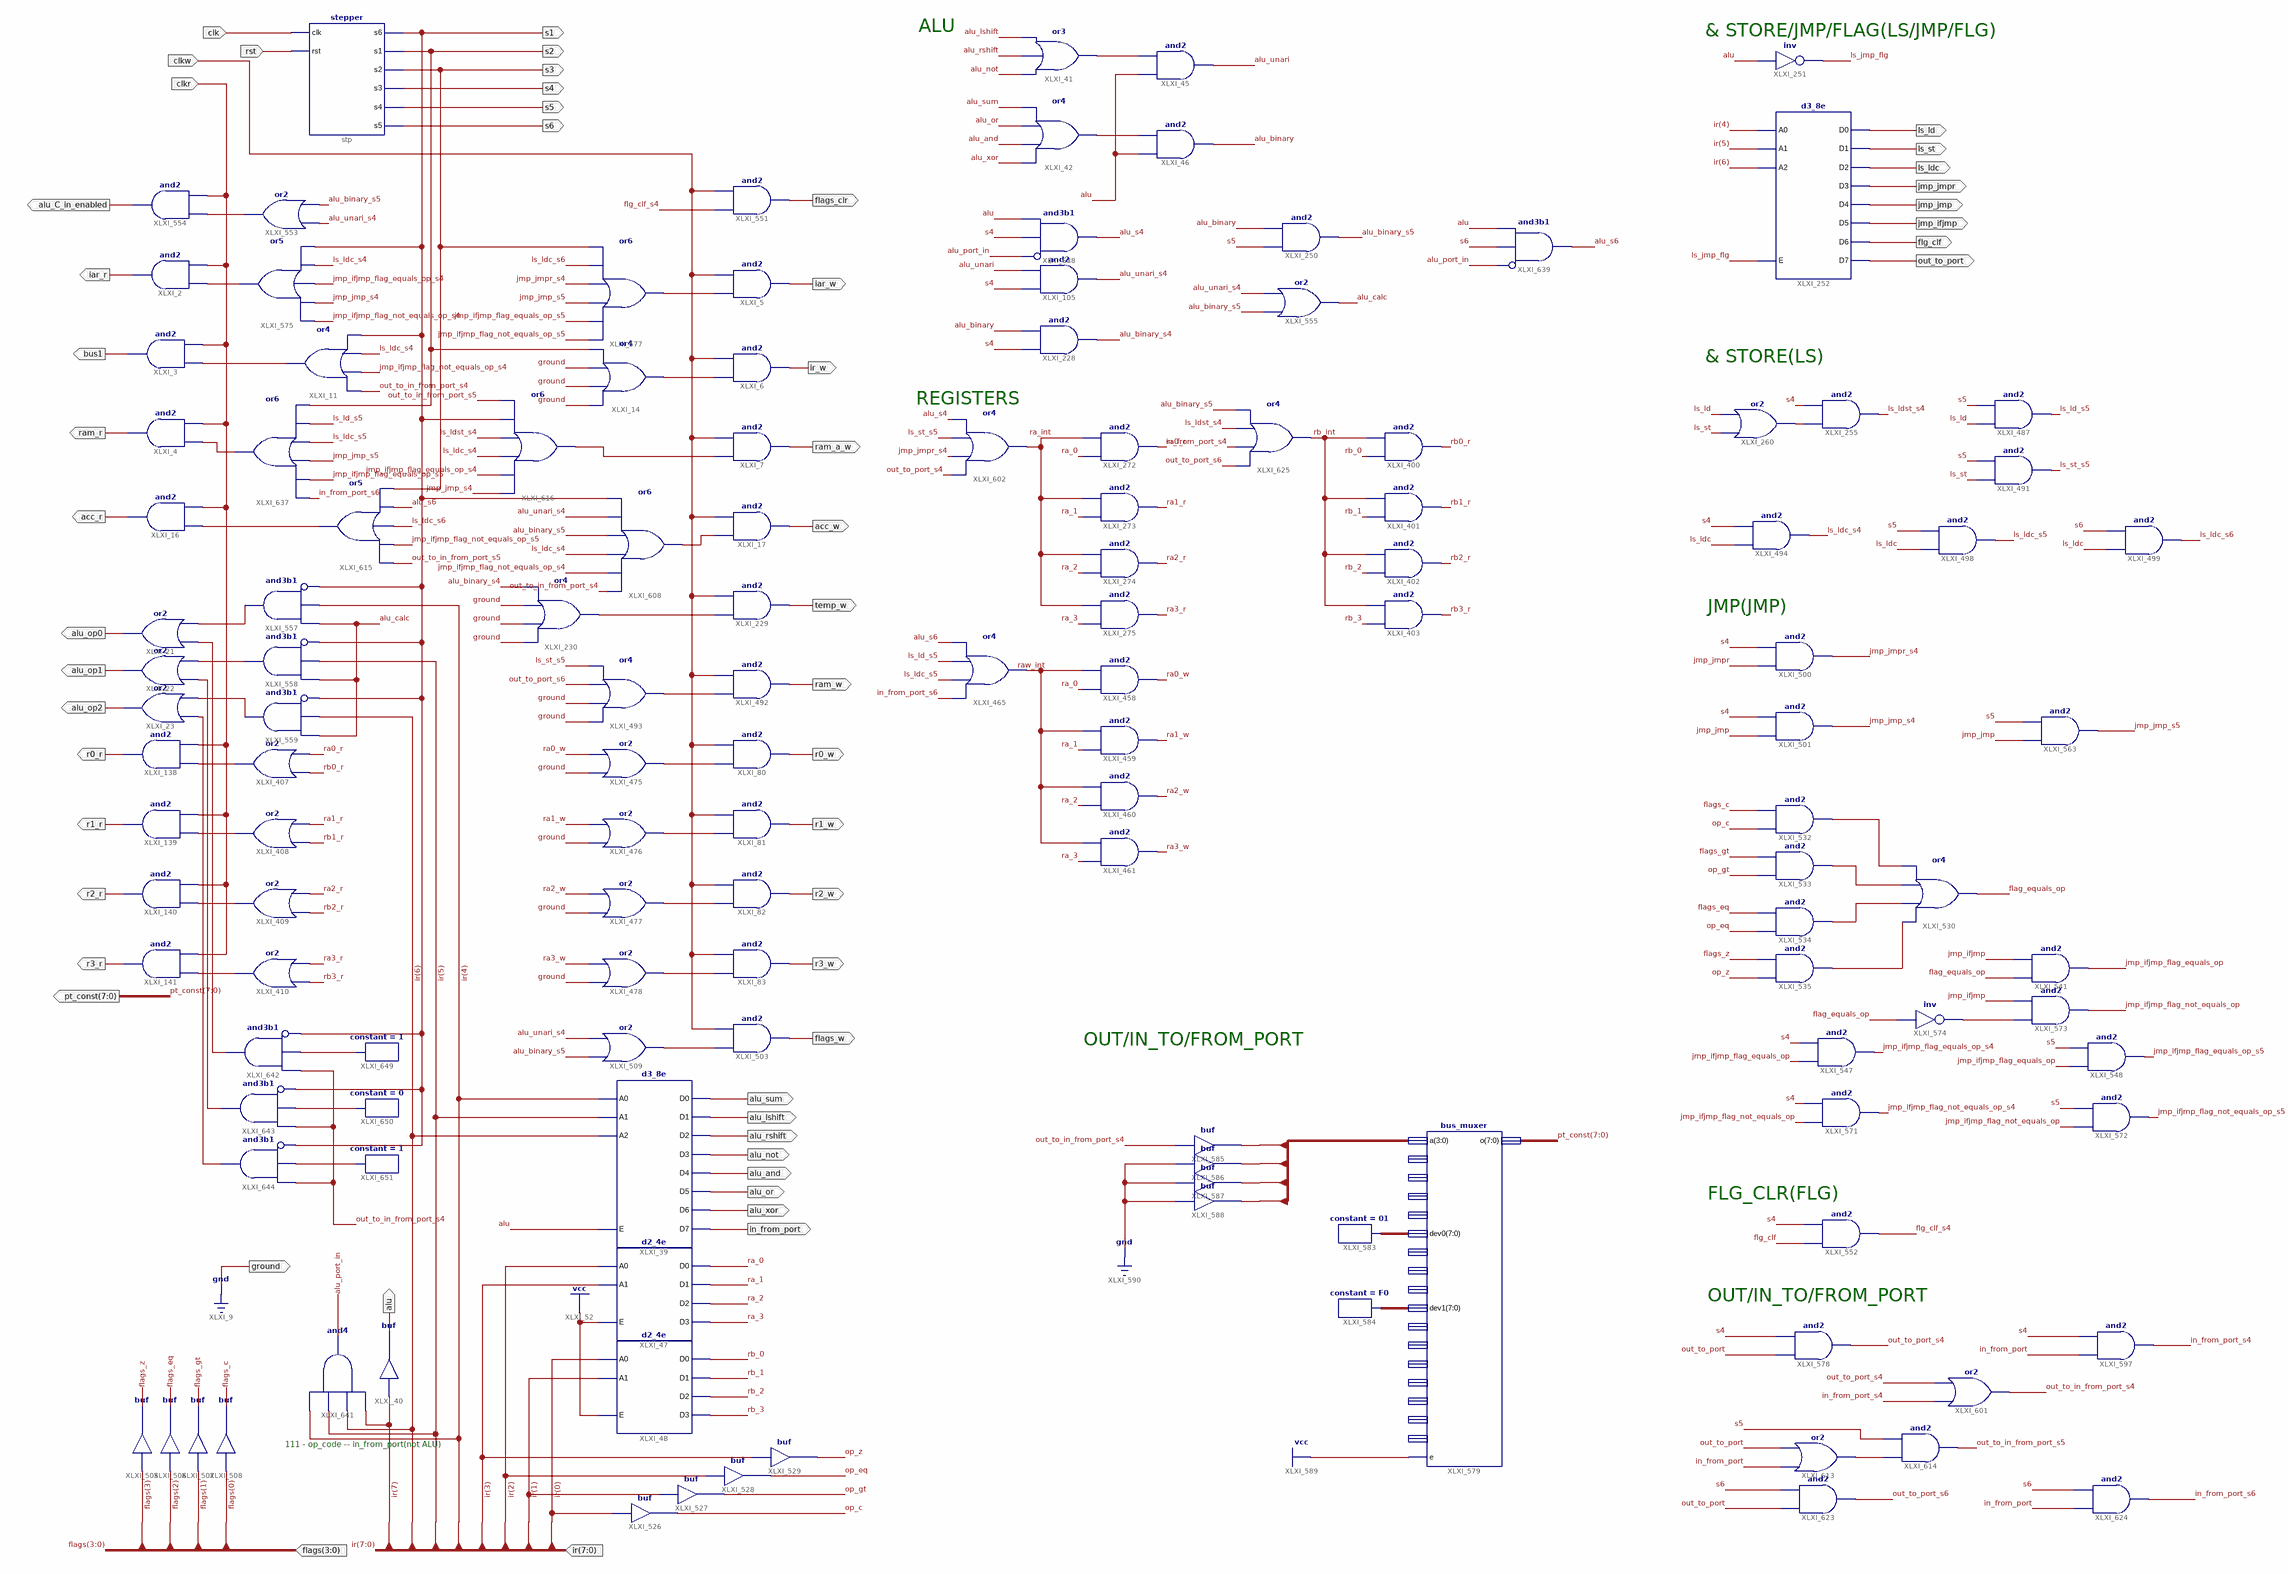
[diagram p0: schematic sheet 1]
// Xilinx ISE schematic cpu_control.sch (aspartan6) as structural Verilog: 131 symbols, 55 ports
module cpu_control (
  input  clk,
  input  clkr,
  input  clkw,
  input  [7:0] ir,
  input  [3:0] flags,
  input  rst,
  output iar_r,
  output bus1,
  output ram_r,
  output s1,
  output acc_r,
  output alu_op0,
  output alu_op1,
  output alu_op2,
  output s2,
  output s3,
  output acc_w,
  output ram_a_w,
  output ir_w,
  output iar_w,
  output alu,
  output alu_sum,
  output alu_lshift,
  output alu_rshift,
  output alu_not,
  output alu_and,
  output alu_or,
  output alu_xor,
  output in_from_port,
  output r0_r,
  output r1_r,
  output r2_r,
  output r3_r,
  output r0_w,
  output r1_w,
  output r2_w,
  output r3_w,
  output s4,
  output s5,
  output s6,
  output ground,
  output temp_w,
  output ls_ld,
  output ls_st,
  output ls_ldc,
  output jmp_jmpr,
  output jmp_jmp,
  output jmp_ifjmp,
  output flg_clf,
  output ram_w,
  output flags_w,
  output flags_clr,
  output alu_C_in_enabled,
  output out_to_port,
  output [7:0] pt_const
);

  wire alu_binary, alu_binary_s4, alu_binary_s5, alu_calc, alu_port_in, alu_s4, alu_s6, alu_unari,
       alu_unari_s4, flag_equals_op, flags_c, flags_eq, flags_gt, flags_z, flg_clf_s4, in_from_port_s4,
       in_from_port_s6, jmp_ifjmp_flag_equals_op, jmp_ifjmp_flag_equals_op_s4, jmp_ifjmp_flag_equals_op_s5,
       jmp_ifjmp_flag_not_equals_op, jmp_ifjmp_flag_not_equals_op_s4, jmp_ifjmp_flag_not_equals_op_s5,
       jmp_jmp_s4, jmp_jmp_s5, jmp_jmpr_s4, ls_jmp_flg, ls_ld_s5, ls_ldc_s4, ls_ldc_s5, ls_ldc_s6,
       ls_ldst_s4, ls_st_s5, op_c, op_eq, op_gt, op_z, out_to_in_from_port_s4, out_to_in_from_port_s5,
       out_to_port_s4, out_to_port_s6, ra0_r, ra0_w, ra1_r, ra1_w, ra2_r, ra2_w, ra3_r, ra3_w, ra_0, ra_1,
       ra_2, ra_3, ra_int, raw_int, rb0_r, rb1_r, rb2_r, rb3_r, rb_0, rb_1, rb_2, rb_3, rb_int, XLXN_4,
       XLXN_5, XLXN_11, XLXN_12, XLXN_16, XLXN_22, XLXN_23, XLXN_30, XLXN_31, XLXN_32, XLXN_83, XLXN_84,
       XLXN_155, XLXN_156, XLXN_157, XLXN_158, XLXN_435, XLXN_462, XLXN_811, XLXN_812, XLXN_813, XLXN_814,
       XLXN_981, XLXN_997, XLXN_1018, XLXN_1019, XLXN_1020, XLXN_1021, XLXN_1034, XLXN_1063, XLXN_1158,
       XLXN_1238, XLXN_1241, XLXN_1242, XLXN_1243, XLXN_1247, XLXN_1248, XLXN_1249;
  wire [3:0] pt_const_addr;
  wire [7:0] XLXN_1076, XLXN_1077;

  stepper stp (.clk(clk), .rst(rst), .s1(s2), .s2(s3), .s3(s4), .s4(s5), .s5(s6), .s6(s1));
  and XLXI_2 (iar_r, clkr, XLXN_4);
  and XLXI_3 (bus1, clkr, XLXN_5);
  and XLXI_4 (ram_r, clkr, XLXN_1238);
  and XLXI_16 (acc_r, clkr, XLXN_22);
  or XLXI_21 (alu_op0, XLXN_30, XLXN_1243);
  or XLXI_22 (alu_op1, XLXN_31, XLXN_1242);
  or XLXI_23 (alu_op2, XLXN_32, XLXN_1241);
  and XLXI_17 (acc_w, XLXN_23, clkw);
  and XLXI_7 (ram_a_w, XLXN_16, clkw);
  or XLXI_14 (XLXN_12, 1'b0, 1'b0, 1'b0, s2);
  and XLXI_6 (ir_w, XLXN_12, clkw);
  and XLXI_5 (iar_w, XLXN_11, clkw);
  d2_4e XLXI_47 (.A0(ir[2]), .A1(ir[3]), .E(1'b1), .D0(ra_0), .D1(ra_1), .D2(ra_2), .D3(ra_3));
  d2_4e XLXI_48 (.A0(ir[0]), .A1(ir[1]), .E(1'b1), .D0(rb_0), .D1(rb_1), .D2(rb_2), .D3(rb_3));
  d3_8e XLXI_39 (
    .A0(ir[4]), .A1(ir[5]), .A2(ir[6]), .E(alu), .D0(alu_sum), .D1(alu_lshift), .D2(alu_rshift),
    .D3(alu_not), .D4(alu_and), .D5(alu_or), .D6(alu_xor), .D7(in_from_port));
  and XLXI_80 (r0_w, XLXN_158, clkw);
  and XLXI_81 (r1_w, XLXN_157, clkw);
  and XLXI_82 (r2_w, XLXN_156, clkw);
  and XLXI_83 (r3_w, XLXN_155, clkw);
  and XLXI_138 (r0_r, clkr, XLXN_811);
  and XLXI_139 (r1_r, clkr, XLXN_812);
  and XLXI_140 (r2_r, clkr, XLXN_813);
  and XLXI_141 (r3_r, clkr, XLXN_814);
  or XLXI_42 (XLXN_84, alu_xor, alu_and, alu_or, alu_sum);
  or XLXI_41 (XLXN_83, alu_not, alu_rshift, alu_lshift);
  and XLXI_45 (alu_unari, alu, XLXN_83);
  and XLXI_46 (alu_binary, alu, XLXN_84);
  and XLXI_229 (temp_w, XLXN_435, clkw);
  d3_8e XLXI_252 (
    .A0(ir[4]), .A1(ir[5]), .A2(ir[6]), .E(ls_jmp_flg), .D0(ls_ld), .D1(ls_st), .D2(ls_ldc), .D3(jmp_jmpr),
    .D4(jmp_jmp), .D5(jmp_ifjmp), .D6(flg_clf), .D7(out_to_port));
  not XLXI_251 (ls_jmp_flg, alu);
  and XLXI_272 (ra0_r, ra_0, ra_int);
  and XLXI_273 (ra1_r, ra_1, ra_int);
  and XLXI_274 (ra2_r, ra_2, ra_int);
  and XLXI_275 (ra3_r, ra_3, ra_int);
  and XLXI_228 (alu_binary_s4, s4, alu_binary);
  and XLXI_105 (alu_unari_s4, s4, alu_unari);
  or XLXI_407 (XLXN_811, ra0_r, rb0_r);
  or XLXI_408 (XLXN_812, ra1_r, rb1_r);
  or XLXI_409 (XLXN_813, ra2_r, rb2_r);
  or XLXI_410 (XLXN_814, ra3_r, rb3_r);
  and XLXI_250 (alu_binary_s5, s5, alu_binary);
  and XLXI_400 (rb0_r, rb_0, rb_int);
  and XLXI_401 (rb1_r, rb_1, rb_int);
  and XLXI_402 (rb2_r, rb_2, rb_int);
  and XLXI_403 (rb3_r, rb_3, rb_int);
  and XLXI_458 (ra0_w, ra_0, raw_int);
  and XLXI_459 (ra1_w, ra_1, raw_int);
  and XLXI_460 (ra2_w, ra_2, raw_int);
  and XLXI_461 (ra3_w, ra_3, raw_int);
  or XLXI_465 (raw_int, in_from_port_s6, ls_ldc_s5, ls_ld_s5, alu_s6);
  or XLXI_475 (XLXN_158, 1'b0, ra0_w);
  or XLXI_476 (XLXN_157, 1'b0, ra1_w);
  or XLXI_477 (XLXN_156, 1'b0, ra2_w);
  or XLXI_478 (XLXN_155, 1'b0, ra3_w);
  and XLXI_255 (ls_ldst_s4, XLXN_462, s4);
  or XLXI_260 (XLXN_462, ls_st, ls_ld);
  and XLXI_487 (ls_ld_s5, ls_ld, s5);
  and XLXI_491 (ls_st_s5, ls_st, s5);
  and XLXI_492 (ram_w, XLXN_981, clkw);
  or XLXI_493 (XLXN_981, 1'b0, 1'b0, out_to_port_s6, ls_st_s5);
  and XLXI_494 (ls_ldc_s4, ls_ldc, s4);
  and XLXI_498 (ls_ldc_s5, ls_ldc, s5);
  and XLXI_499 (ls_ldc_s6, ls_ldc, s6);
  and XLXI_500 (jmp_jmpr_s4, jmp_jmpr, s4);
  and XLXI_501 (jmp_jmp_s4, jmp_jmp, s4);
  and XLXI_503 (flags_w, XLXN_997, clkw);
  buf XLXI_505 (flags_z, flags[3]);
  buf XLXI_506 (flags_eq, flags[2]);
  buf XLXI_507 (flags_gt, flags[1]);
  buf XLXI_508 (flags_c, flags[0]);
  or XLXI_509 (XLXN_997, alu_binary_s5, alu_unari_s4);
  buf XLXI_526 (op_c, ir[0]);
  buf XLXI_527 (op_gt, ir[1]);
  buf XLXI_528 (op_eq, ir[2]);
  buf XLXI_529 (op_z, ir[3]);
  or XLXI_530 (flag_equals_op, XLXN_1021, XLXN_1020, XLXN_1019, XLXN_1018);
  and XLXI_532 (XLXN_1018, op_c, flags_c);
  and XLXI_533 (XLXN_1019, op_gt, flags_gt);
  and XLXI_534 (XLXN_1020, op_eq, flags_eq);
  and XLXI_535 (XLXN_1021, op_z, flags_z);
  and XLXI_541 (jmp_ifjmp_flag_equals_op, flag_equals_op, jmp_ifjmp);
  and XLXI_551 (flags_clr, flg_clf_s4, clkw);
  and XLXI_554 (alu_C_in_enabled, clkr, XLXN_1034);
  or XLXI_553 (XLXN_1034, alu_binary_s5, alu_unari_s4);
  or XLXI_555 (alu_calc, alu_binary_s5, alu_unari_s4);
  and XLXI_557 (XLXN_30, ~s1, ir[4], alu_calc);  // and3b1
  and XLXI_558 (XLXN_31, ~s1, ir[5], alu_calc);  // and3b1
  and XLXI_559 (XLXN_32, ~s1, ir[6], alu_calc);  // and3b1
  and XLXI_563 (jmp_jmp_s5, jmp_jmp, s5);
  and XLXI_547 (jmp_ifjmp_flag_equals_op_s4, jmp_ifjmp_flag_equals_op, s4);
  and XLXI_548 (jmp_ifjmp_flag_equals_op_s5, jmp_ifjmp_flag_equals_op, s5);
  and XLXI_571 (jmp_ifjmp_flag_not_equals_op_s4, jmp_ifjmp_flag_not_equals_op, s4);
  and XLXI_572 (jmp_ifjmp_flag_not_equals_op_s5, jmp_ifjmp_flag_not_equals_op, s5);
  and XLXI_573 (jmp_ifjmp_flag_not_equals_op, XLXN_1063, jmp_ifjmp);
  not XLXI_574 (XLXN_1063, flag_equals_op);
  or XLXI_575 (XLXN_4, s1, ls_ldc_s4, jmp_ifjmp_flag_equals_op_s4, jmp_jmp_s4, jmp_ifjmp_flag_not_equals_op_s4);
  or XLXI_577 (XLXN_11, jmp_ifjmp_flag_not_equals_op_s5, jmp_ifjmp_flag_equals_op_s5, jmp_jmp_s5, jmp_jmpr_s4, ls_ldc_s6, s3);
  bus_muxer XLXI_579 (
    .a(pt_const_addr), .dev0(XLXN_1076), .dev1(XLXN_1077), .e(1'b1), .o(pt_const));  // open: dev10, dev11, dev12, dev13, dev14, dev15, dev2, dev3, dev4, dev5, dev6, dev7, dev8, dev9
  constant #(.CValue("01")) XLXI_583 (.O(XLXN_1076));
  constant #(.CValue("F0")) XLXI_584 (.O(XLXN_1077));
  buf XLXI_585 (pt_const_addr[0], out_to_in_from_port_s4);
  buf XLXI_586 (pt_const_addr[1], 1'b0);
  buf XLXI_587 (pt_const_addr[2], 1'b0);
  buf XLXI_588 (pt_const_addr[3], 1'b0);
  buf XLXI_40 (alu, ir[7]);
  or XLXI_602 (ra_int, out_to_port_s4, jmp_jmpr_s4, ls_st_s5, alu_s4);
  or XLXI_608 (XLXN_23, out_to_in_from_port_s4, jmp_ifjmp_flag_not_equals_op_s4, ls_ldc_s4, alu_binary_s5, alu_unari_s4, s1);
  or XLXI_230 (XLXN_435, 1'b0, 1'b0, 1'b0, alu_binary_s4);
  or XLXI_616 (XLXN_16, jmp_jmp_s4, jmp_ifjmp_flag_equals_op_s4, ls_ldc_s4, ls_ldst_s4, s1, out_to_in_from_port_s5);
  and XLXI_552 (flg_clf_s4, flg_clf, s4);
  and XLXI_578 (out_to_port_s4, out_to_port, s4);
  and XLXI_597 (in_from_port_s4, in_from_port, s4);
  or XLXI_601 (out_to_in_from_port_s4, in_from_port_s4, out_to_port_s4);
  or XLXI_613 (XLXN_1158, in_from_port, out_to_port);
  and XLXI_614 (out_to_in_from_port_s5, XLXN_1158, s5);
  and XLXI_623 (out_to_port_s6, out_to_port, s6);
  and XLXI_624 (in_from_port_s6, in_from_port, s6);
  or XLXI_625 (rb_int, out_to_port_s6, in_from_port_s4, ls_ldst_s4, alu_binary_s5);
  or XLXI_11 (XLXN_5, s1, ls_ldc_s4, jmp_ifjmp_flag_not_equals_op_s4, out_to_in_from_port_s4);
  or XLXI_637 (XLXN_1238, s2, ls_ld_s5, ls_ldc_s5, jmp_jmp_s5, jmp_ifjmp_flag_equals_op_s5, in_from_port_s6);
  or XLXI_615 (XLXN_22, s3, alu_s6, ls_ldc_s6, jmp_ifjmp_flag_not_equals_op_s5, out_to_in_from_port_s5);
  and XLXI_638 (alu_s4, ~alu_port_in, s4, alu);  // and3b1
  and XLXI_639 (alu_s6, ~alu_port_in, s6, alu);  // and3b1
  and XLXI_641 (alu_port_in, ir[7], ir[6], ir[5], ir[4]);
  and XLXI_642 (XLXN_1243, ~s1, XLXN_1247, out_to_in_from_port_s4);  // and3b1
  and XLXI_643 (XLXN_1242, ~s1, XLXN_1248, out_to_in_from_port_s4);  // and3b1
  and XLXI_644 (XLXN_1241, ~s1, XLXN_1249, out_to_in_from_port_s4);  // and3b1
  constant #(.CValue("1")) XLXI_649 (.O(XLXN_1247));
  constant #(.CValue("0")) XLXI_650 (.O(XLXN_1248));
  constant #(.CValue("1")) XLXI_651 (.O(XLXN_1249));

  assign ground = 1'b0;

  // Notes on the sheet:
  //   ALU
  //   & STORE/JMP/FLAG(LS/JMP/FLG)
  //   & STORE(LS)
  //   REGISTERS
  //   JMP(JMP)
  //   OUT/IN_TO/FROM_PORT
  //   FLG_CLR(FLG)
  //   OUT/IN_TO/FROM_PORT
  //   111 - op_code -- in_from_port(not ALU)
endmodule
